# EAGLE design sanguinololu (EAGLE 5.11)
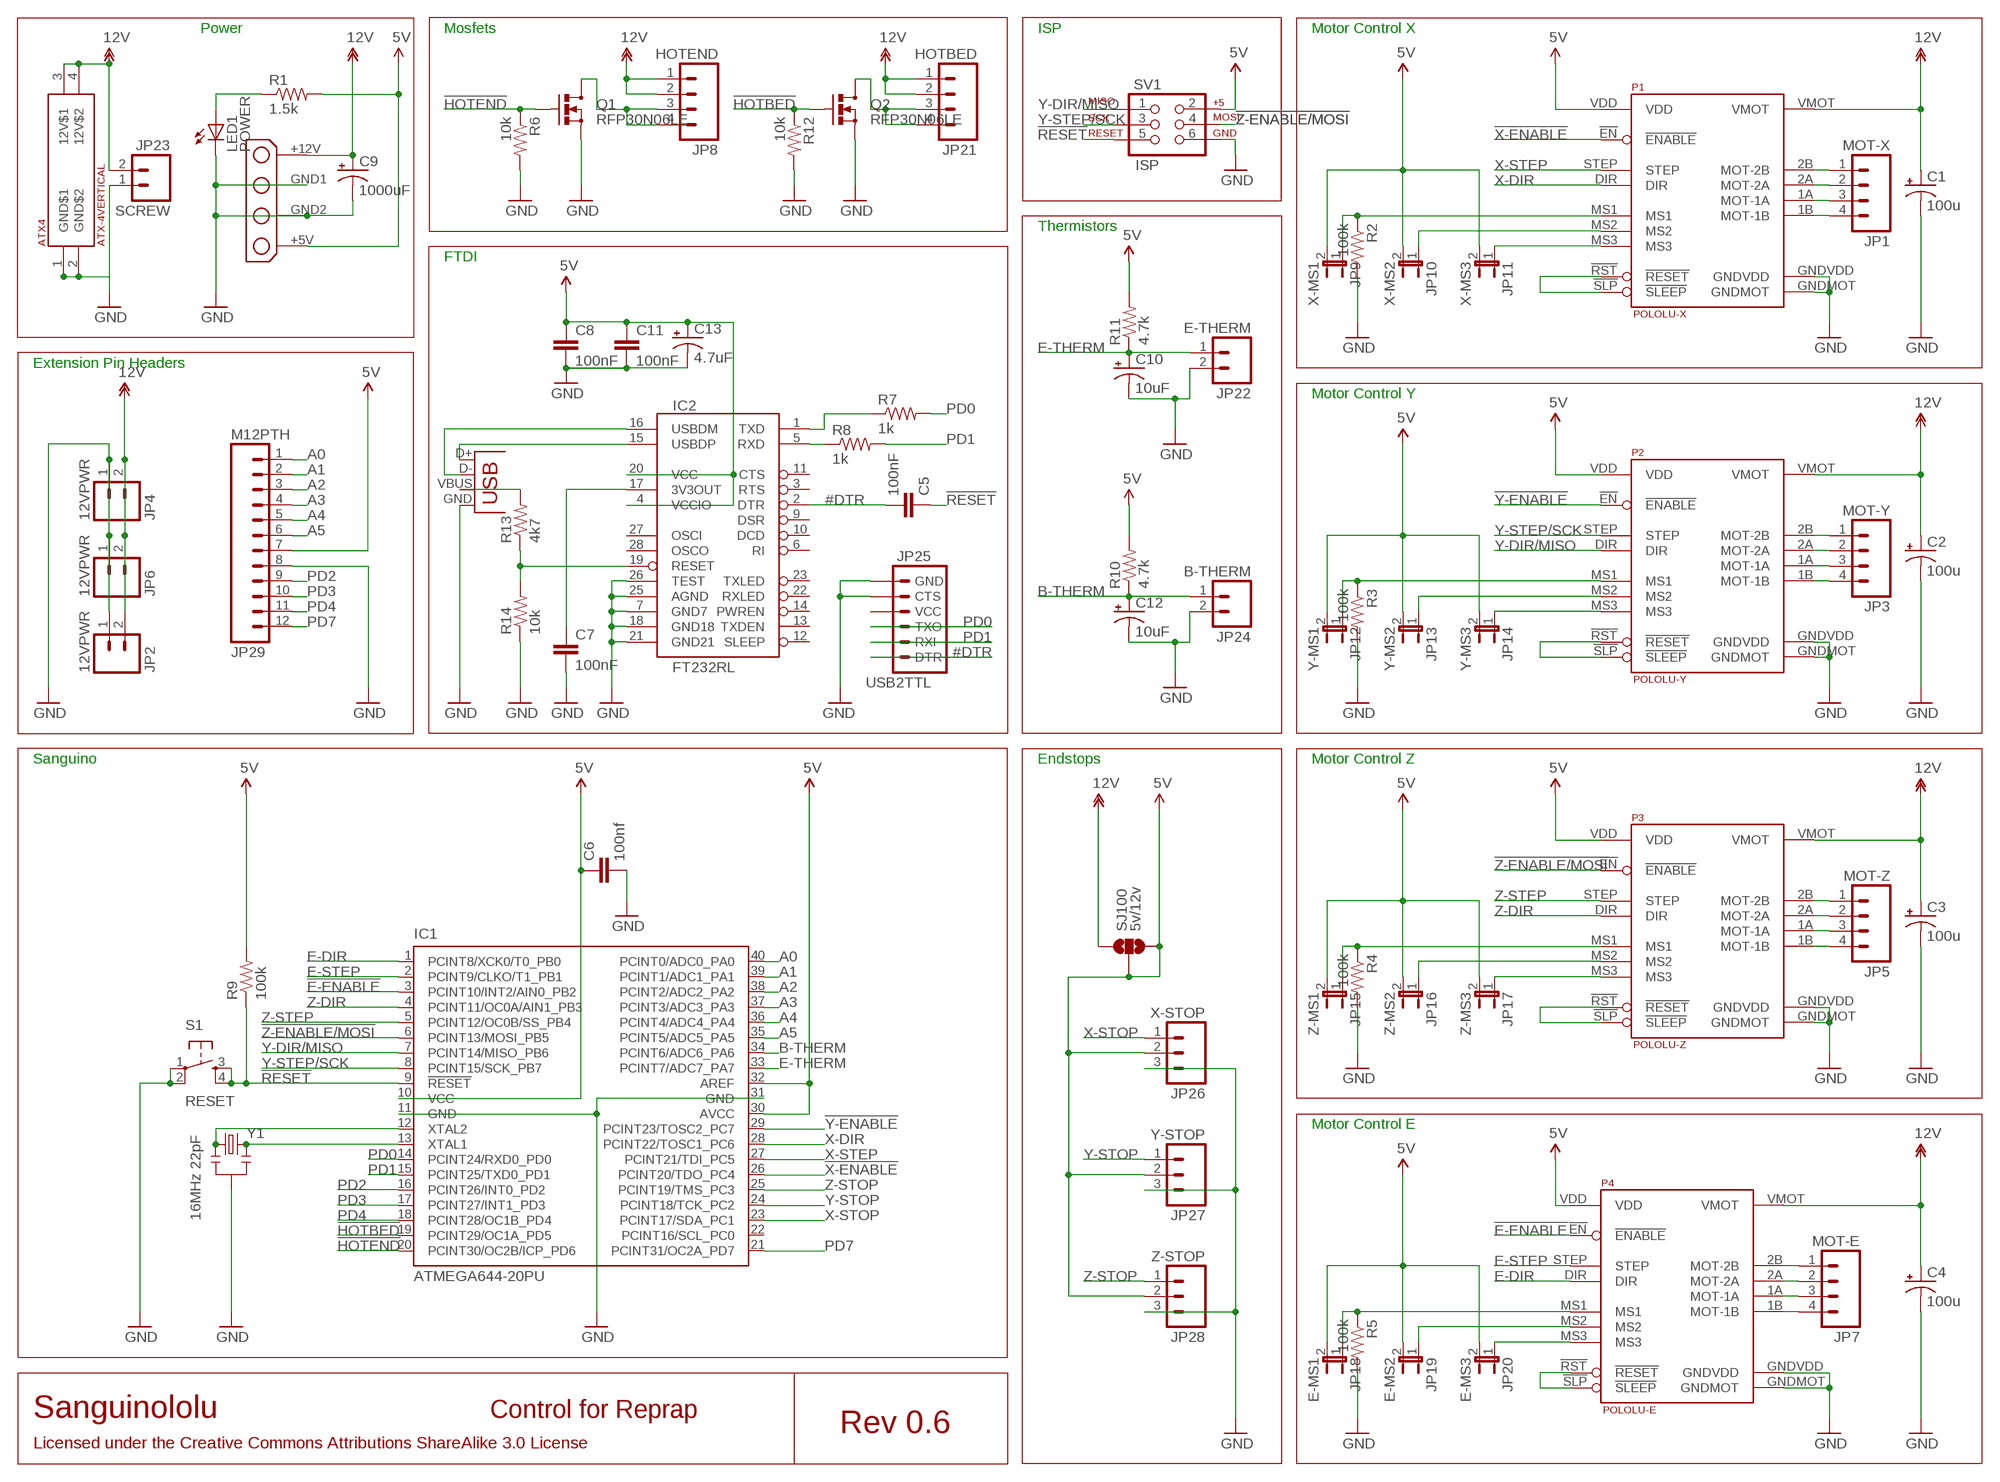
[diagram p0: schematic, sheet 1]

## Parts
ATX4  ATX-4VERTICAL  [MINIFITJR-4-VERTICAL]
C1  100u  CAP_POLPTH1  [CPOL-RADIAL-100UF-25V]
C2  100u  CAP_POLPTH1  [CPOL-RADIAL-100UF-25V]
C3  100u  CAP_POLPTH1  [CPOL-RADIAL-100UF-25V]
C4  100u  CAP_POLPTH1  [CPOL-RADIAL-100UF-25V]
C5  100nF  CAPPTH2  [CAP-PTH-SMALL2]
C6  100nf  CAPPTH2  [CAP-PTH-SMALL2]
C7  100nF  CAPPTH2  [CAP-PTH-SMALL2]
C8  100nF  CAPPTH2  [CAP-PTH-SMALL2]
C9  1000uF  CAP_POLPTH4  [CPOL-RADIAL-1000UF-25V]
C10  10uF  CAP_POLPTH2  [CPOL-RADIAL-10UF-25V]
C11  100nF  CAPPTH2  [CAP-PTH-SMALL2]
C12  10uF  CAP_POLPTH2  [CPOL-RADIAL-10UF-25V]
C13  4.7uF  CAP_POLPTH2  [CPOL-RADIAL-10UF-25V]
HDDPWR  5v/12v  DRIVEPWRVERTICAL  [HDD-VERTICAL]
IC1  ATMEGA644-20PU  [DIL40]
IC2  FT232RL  FT232RLSSOP  [SSOP28DB]
J1  USB  USBPTH  [USB-B-PTH]
JP1  MOT-X  M04POLAR  [MOLEX-1X4]
JP2  12VPWR  M02POLAR  [MOLEX-1X2]
JP3  MOT-Y  M04POLAR  [MOLEX-1X4]
JP4  12VPWR  M02POLAR  [MOLEX-1X2]
JP5  MOT-Z  M04POLAR  [MOLEX-1X4]
JP6  12VPWR  M02POLAR  [MOLEX-1X2]
JP7  MOT-E  M04POLAR  [MOLEX-1X4]
JP8  HOTEND  M04POLAR  [MOLEX-1X4]
JP9  X-MS1  JUMPER-2PTH  [1X02]
JP10  X-MS2  JUMPER-2PTH  [1X02]
JP11  X-MS3  JUMPER-2PTH  [1X02]
JP12  Y-MS1  JUMPER-2PTH  [1X02]
JP13  Y-MS2  JUMPER-2PTH  [1X02]
JP14  Y-MS3  JUMPER-2PTH  [1X02]
JP15  Z-MS1  JUMPER-2PTH  [1X02]
JP16  Z-MS2  JUMPER-2PTH  [1X02]
JP17  Z-MS3  JUMPER-2PTH  [1X02]
JP18  E-MS1  JUMPER-2PTH  [1X02]
JP19  E-MS2  JUMPER-2PTH  [1X02]
JP20  E-MS3  JUMPER-2PTH  [1X02]
JP21  HOTBED  M04POLAR  [MOLEX-1X4]
JP22  E-THERM  M02PTH  [1X02]
JP23  SCREW  M025MM  [SCREWTERMINAL-5MM-2]
JP24  B-THERM  M02PTH  [1X02]
JP25  USB2TTL  ARDUINO_SERIAL_PROGRAMPTH  [1X06]
JP26  X-STOP  M03POLAR  [MOLEX-1X3]
JP27  Y-STOP  M03POLAR  [MOLEX-1X3]
JP28  Z-STOP  M03POLAR  [MOLEX-1X3]
JP29  M12PTH  [1X12]
LED1  POWER  LED3MM  [LED3MM]
P1  POLOLU-X  POLOLU-ALLEGRO  [POLOLU-ALLEGRO-PTH]
P2  POLOLU-Y  POLOLU-ALLEGRO  [POLOLU-ALLEGRO-PTH]
P3  POLOLU-Z  POLOLU-ALLEGRO  [POLOLU-ALLEGRO-PTH]
P4  POLOLU-E  POLOLU-ALLEGRO  [POLOLU-ALLEGRO-PTH]
Q1  RFP30N06LE  MOSFET-NCHANNELPTH2  [TO220V]
Q2  RFP30N06LE  MOSFET-NCHANNELPTH2  [TO220V]
R1  1.5k  RESISTORPTH1  [AXIAL-0.3]
R2  100k  RESISTORPTH1  [AXIAL-0.3]
R3  100k  RESISTORPTH1  [AXIAL-0.3]
R4  100k  RESISTORPTH1  [AXIAL-0.3]
R5  100k  RESISTORPTH1  [AXIAL-0.3]
R6  10k  RESISTORPTH1  [AXIAL-0.3]
R7  1k  RESISTORPTH1  [AXIAL-0.3]
R8  1k  RESISTORPTH1  [AXIAL-0.3]
R9  100k  RESISTORPTH1  [AXIAL-0.3]
R10  4.7k  RESISTORPTH1  [AXIAL-0.3]
R11  4.7k  RESISTORPTH1  [AXIAL-0.3]
R12  10k  RESISTORPTH1  [AXIAL-0.3]
R13  4k7  RESISTORPTH1  [AXIAL-0.3]
R14  10k  RESISTORPTH1  [AXIAL-0.3]
S1  RESET  TAC_SWITCHPTH  [TACTILE-PTH]
SJ100  5v/12v  SOLDERJUMPER_2WAYS  [SJ_3]
SV1  ISP  AVR_SPI_PRG_6PTH  [2X3]
Y1  16MHz 22pF  RESONATORPTH  [RESONATOR-PTH]

## Nets
3V3: C7.1 IC2.17(3V3OUT)
5V: C6.1 C8.1 C11.1 C13.1(+) HDDPWR.+5V IC1.10(VCC) IC1.30(AVCC) IC1.32(AREF) IC2.4(VCCIO) IC2.20(VCC) JP9.2 JP10.2 JP11.2 JP12.2 JP13.2 JP14.2 JP15.2 JP16.2 JP17.2 JP18.2 JP19.2 JP20.2 JP26.2 JP27.2 JP28.2 JP29.7 P1.VDD P2.VDD P3.VDD P4.VDD R1.P$2 R9.P$2 R10.P$2 R11.P$2 SJ100.2 SJ100.3 SV1.2
12V: ATX4.3(12V$1) ATX4.4(12V$2) C1.1(+) C2.1(+) C3.1(+) C4.1(+) C9.1(+) HDDPWR.+12V JP2.2 JP4.2 JP6.2 JP8.1 JP8.2 JP21.1 JP21.2 JP23.2 P1.VMOT P2.VMOT P3.VMOT P4.VMOT SJ100.1
!E-ENABLE: IC1.3(PCINT10/INT2/AIN0_PB2) P4.!EN(!ENABLE)
!HOTBED: IC1.19(PCINT29/OC1A_PD5) Q2.1(G) R12.P$1
!HOTEND: IC1.20(PCINT30/OC2B/ICP_PD6) Q1.1(G) R6.P$1
!RESET: C5.1 IC1.9(!RESET) R9.P$1 S1.3 S1.4 SV1.5
!USB-RESET: IC2.19(RESET) R13.P$1 R14.P$2
!X-ENABLE: IC1.26(PCINT20/TDO_PC4) P1.!EN(!ENABLE)
!Y-ENABLE: IC1.29(PCINT23/TOSC2_PC7) P2.!EN(!ENABLE)
!Z-ENABLE/MOSI: IC1.6(PCINT13/MOSI_PB5) P3.!EN(!ENABLE) SV1.4
#DTR: C5.2 IC2.2(DTR) JP25.1(DTR)
A0: IC1.40(PCINT0/ADC0_PA0) JP29.1
A1: IC1.39(PCINT1/ADC1_PA1) JP29.2
A2: IC1.38(PCINT2/ADC2_PA2) JP29.3
A3: IC1.37(PCINT3/ADC3_PA3) JP29.4
A4: IC1.36(PCINT4/ADC4_PA4) JP29.5
A5: IC1.35(PCINT5/ADC5_PA5) JP29.6
B-THERM: C12.1(+) IC1.34(PCINT6/ADC6_PA6) JP24.1 R10.P$1
E-DIR: IC1.1(PCINT8/XCK0/T0_PB0) P4.DIR
E-MOT-1A1 [power]: JP7.3 P4.1A(MOT-1A)
E-MOT-1B1 [power]: JP7.4 P4.1B(MOT-1B)
E-MOT-2A1 [power]: JP7.2 P4.2A(MOT-2A)
E-MOT-2B1 [power]: JP7.1 P4.2B(MOT-2B)
E-MS1: JP18.1 P4.MS1 R5.P$1
E-MS2: JP19.1 P4.MS2
E-MS3: JP20.1 P4.MS3
E-RESETSLEEP: P4.!RST(!RESET) P4.!SLP(!SLEEP)
E-STEP: IC1.2(PCINT9/CLKO/T1_PB1) P4.STEP
E-THERM: C10.1(+) IC1.33(PCINT7/ADC7_PA7) JP22.1 R11.P$1
GND [power]: ATX4.1(GND$1) ATX4.2(GND$2) C1.2(-) C2.2(-) C3.2(-) C4.2(-) C6.2 C7.2 C8.2 C9.2(-) C10.2(-) C11.2 C12.2(-) C13.2(-) HDDPWR.GND1(GND) HDDPWR.GND2(_GND) IC1.11(GND) IC1.31(GND) IC2.7(GND7) IC2.18(GND18) IC2.21(GND21) IC2.25(AGND) IC2.26(TEST) J1.GND JP2.1 JP4.1 JP6.1 JP22.2 JP23.1 JP24.2 JP25.5(CTS) JP25.6(GND) JP26.3 JP27.3 JP28.3 JP29.8 LED1.K(C) P1.GNDMOT P1.GNDVDD P2.GNDMOT P2.GNDVDD P3.GNDMOT P3.GNDVDD P4.GNDMOT P4.GNDVDD Q1.3(S) Q2.3(S) R2.P$2 R3.P$2 R4.P$2 R5.P$2 R6.P$2 R12.P$2 R14.P$1 S1.1 S1.2 SV1.6 Y1.2
HOTBED-GND [power]: JP21.3 JP21.4 Q2.2(D)
HOTEND-GND [power]: JP8.3 JP8.4 Q1.2(D)
LED1: LED1.A R1.P$1
PD0: IC1.14(PCINT24/RXD0_PD0) JP25.3(TXO) R7.P$2
PD1: IC1.15(PCINT25/TXD0_PD1) JP25.2(RXI) R8.P$2
PD2: IC1.16(PCINT26/INT0_PD2) JP29.9
PD3: IC1.17(PCINT27/INT1_PD3) JP29.10
PD4: IC1.18(PCINT28/OC1B_PD4) JP29.11
PD7: IC1.21(PCINT31/OC2A_PD7) JP29.12
USB-RXD: IC2.5(RXD) R8.P$1
USB-TXD: IC2.1(TXD) R7.P$1
USBDM: IC2.16(USBDM) J1.D-
USBDP: IC2.15(USBDP) J1.D+
VBUS: J1.VBUS R13.P$2
X-DIR: IC1.28(PCINT22/TOSC1_PC6) P1.DIR
X-MOT-1A [power]: JP1.3 P1.1A(MOT-1A)
X-MOT-1B [power]: JP1.4 P1.1B(MOT-1B)
X-MOT-2A [power]: JP1.2 P1.2A(MOT-2A)
X-MOT-2B [power]: JP1.1 P1.2B(MOT-2B)
X-MS1: JP9.1 P1.MS1 R2.P$1
X-MS2: JP10.1 P1.MS2
X-MS3: JP11.1 P1.MS3
X-RESETSLEEP: P1.!RST(!RESET) P1.!SLP(!SLEEP)
X-STEP: IC1.27(PCINT21/TDI_PC5) P1.STEP
X-STOP: IC1.23(PCINT17/SDA_PC1) JP26.1
XTAL1: IC1.13(XTAL1) Y1.3
XTAL2: IC1.12(XTAL2) Y1.1
Y-DIR/MISO: IC1.7(PCINT14/MISO_PB6) P2.DIR SV1.1
Y-MOT-1A [power]: JP3.3 P2.1A(MOT-1A)
Y-MOT-1B [power]: JP3.4 P2.1B(MOT-1B)
Y-MOT-2A [power]: JP3.2 P2.2A(MOT-2A)
Y-MOT-2B [power]: JP3.1 P2.2B(MOT-2B)
Y-MS1: JP12.1 P2.MS1 R3.P$1
Y-MS2: JP13.1 P2.MS2
Y-MS3: JP14.1 P2.MS3
Y-RESETSLEEP: P2.!RST(!RESET) P2.!SLP(!SLEEP)
Y-STEP/SCK: IC1.8(PCINT15/SCK_PB7) P2.STEP SV1.3
Y-STOP: IC1.24(PCINT18/TCK_PC2) JP27.1
Z-DIR: IC1.4(PCINT11/OC0A/AIN1_PB3) P3.DIR
Z-MOT-1A [power]: JP5.3 P3.1A(MOT-1A)
Z-MOT-1B [power]: JP5.4 P3.1B(MOT-1B)
Z-MOT-2A [power]: JP5.2 P3.2A(MOT-2A)
Z-MOT-2B [power]: JP5.1 P3.2B(MOT-2B)
Z-MS1: JP15.1 P3.MS1 R4.P$1
Z-MS2: JP16.1 P3.MS2
Z-MS3: JP17.1 P3.MS3
Z-RESETSLEEP: P3.!RST(!RESET) P3.!SLP(!SLEEP)
Z-STEP: IC1.5(PCINT12/OC0B/SS_PB4) P3.STEP
Z-STOP: IC1.25(PCINT19/TMS_PC3) JP28.1
Unconnected: IC1.22(PCINT16/SCL_PC0) IC2.3(RTS) IC2.6(RI) IC2.9(DSR) IC2.10(DCD) IC2.11(CTS) IC2.12(SLEEP) IC2.13(TXDEN) IC2.14(PWREN) IC2.22(RXLED) IC2.23(TXLED) IC2.27(OSCI) IC2.28(OSCO) JP25.4(VCC)

## Notes on the sheet
- Power | Mosfets | ISP | Motor Control X
- Thermistors
- FTDI
- Extension Pin Headers
- Motor Control Y
- Sanguino | Endstops | Motor Control Z
- Motor Control E
- Sanguinololu | Control for Reprap
- Rev 0.6
- Licensed under the Creative Commons Attributions ShareAlike 3.0 License

## Library data of the parts
ATX4 = atx-power-supply:ATX-4
C1-C4 C9 C10 C12 C13 = SparkFun:CAP_POL: Capacitor Polarized These are standard SMD and PTH capacitors. Normally 10uF, 47uF, and 100uF in electrolytic and tantalum varieties. Always verify the external diameter of the through hole cap, it varies with capacity, voltage, and manufacturer. The EIA devices should be standard.
C5-C8 C11 = SparkFun:CAP: Capacitor Standard 0603 ceramic capacitor, and 0.1" leaded capacitor.
HDDPWR = atx-power-supply:DRIVEPWR
IC1 = atmel:ATMEGA644-*PU: 8-bit Microcontroller with 64K Bytes In-System Programmable Flash Auto generated by make-symbol-device-package-bsdl.ulp Rev. 34 Source: http://www.atmel.com/dyn/resources/prod_documents/doc2593.pdf; MPN: ATMEGA644-20PU; OC_FARNELL: 1288340; OC_NEWARK: 23M5060
IC2 = SparkFun:FT232RL: USB UART FT232RL 4th Generation USB UART (USB <-> Serial) Controller. Spark Fun Electronics SKU : COM-00650
J1 = SparkFun:USB: USB Connectors USB-B-PTH is fully proven SKU : PRT-00139 USB-miniB is fully proven SKU : PRT-00587 USB-A-PCB is untested. USB-A-H is throughly reviewed, but untested. Spark Fun Electronics SKU : PRT-00437 USB-B-SMT is throughly reviewed, but untested. Needs silkscreen touching up. USB-A-S has not been used/tested USB-MB-H has not been used/tested
JP1 JP3 JP5 JP7 JP8 JP21 = SparkFun:M04: Header 4 Standard 4-pin 0.1" header. Use with straight break away headers (SKU : PRT-00116), right angle break away headers (PRT-00553), swiss pins (PRT-00743), machine pins (PRT-00117), and female headers (PRT-00115). Molex polarized connector foot print use with SKU : PRT-08231 with associated crimp pins and housings.
JP2 JP4 JP6 JP22-JP24 = SparkFun:M02: Header 2 Standard 2-pin 0.1" header. Use with straight break away headers (SKU : PRT-00116), right angle break away headers (PRT-00553), swiss pins (PRT-00743), machine pins (PRT-00117), and female headers (PRT-00115). Molex polarized connector foot print use with SKU : PRT-08233 with associated crimp pins and housings.
JP9-JP20 = SparkFun:JUMPER-2: Jumper Basic 0.1" spaced jumper. Use with breakaway headers.
JP25 = SparkFun:ARDUINO_SERIAL_PROGRAM
JP26-JP28 = SparkFun:M03: Header 3 Standard 3-pin 0.1" header. Use with straight break away headers (SKU : PRT-00116), right angle break away headers (PRT-00553), swiss pins (PRT-00743), machine pins (PRT-00117), and female headers (PRT-00115). Molex polarized connector foot print use with SKU : PRT-08232 with associated crimp pins and housings.
JP29 = SparkFun:M12: Header 12 Standard 12-pin 0.1" header. Use with straight break away headers (SKU : PRT-00116), right angle break away headers (PRT-00553), swiss pins (PRT-00743), machine pins (PRT-00117), and female headers (PRT-00115).
LED1 = SparkFun:LED: LEDs Standard schematic elements and footprints for 5mm, 3mm, 1206, and 0603 sized LEDs. 5mm - Spark Fun Electronics SKU : COM-00529 (and others)
P1-P4 = pololu-allegro:POLOLU-ALLEGRO
Q1 Q2 = SparkFun:MOSFET-NCHANNEL
R1-R14 = SparkFun:RESISTOR: Resistor Basic schematic elements and footprints for 0603, 1206, and PTH 1/10th watt (small) resistors.
S1 = SparkFun:TAC_SWITCH: Momentary Switch Button commonly used for reset or general input. Spark Fun Electronics SKU : COM-00097
SJ100 = SparkFun:SOLDERJUMPER_2WAY: Solder Jumper 2 way solder jumper
SV1 = SparkFun:AVR_SPI_PRG_6: AVR ISP 6 Pin This is the reduced ISP connector for AVR programming. Common on Arduino. This footprint will take up less PCB space and can be used with a 10-pin to 6-pin adapter such as SKU: BOB-08508
Y1 = SparkFun:RESONATOR: Resonator Small SMD resonator. This is the itty bitty 10/20MHz resonators with built in caps. CSTCE10M0G55 and CSTCE20M0V53. Footprint has been reviewed closely but hasn't been tested yet.

## Board
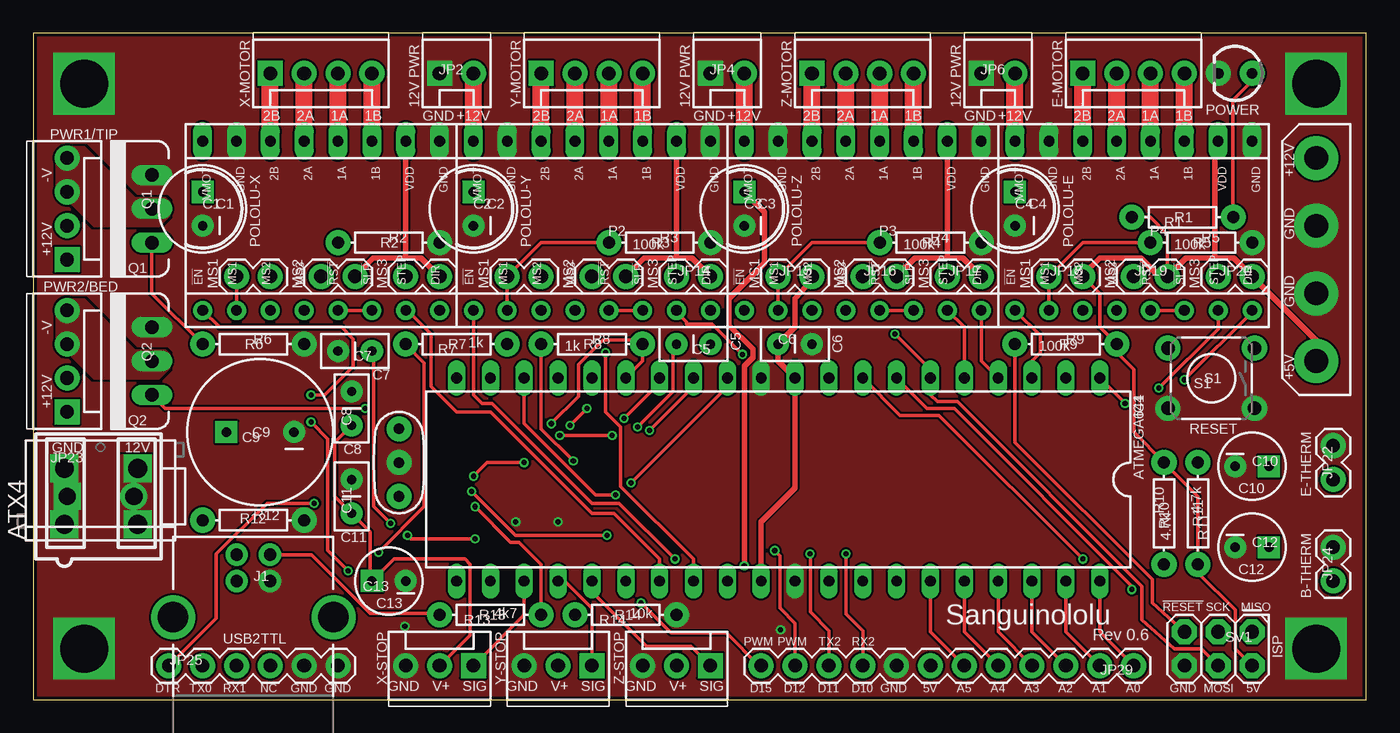
[diagram p1: board, top side]
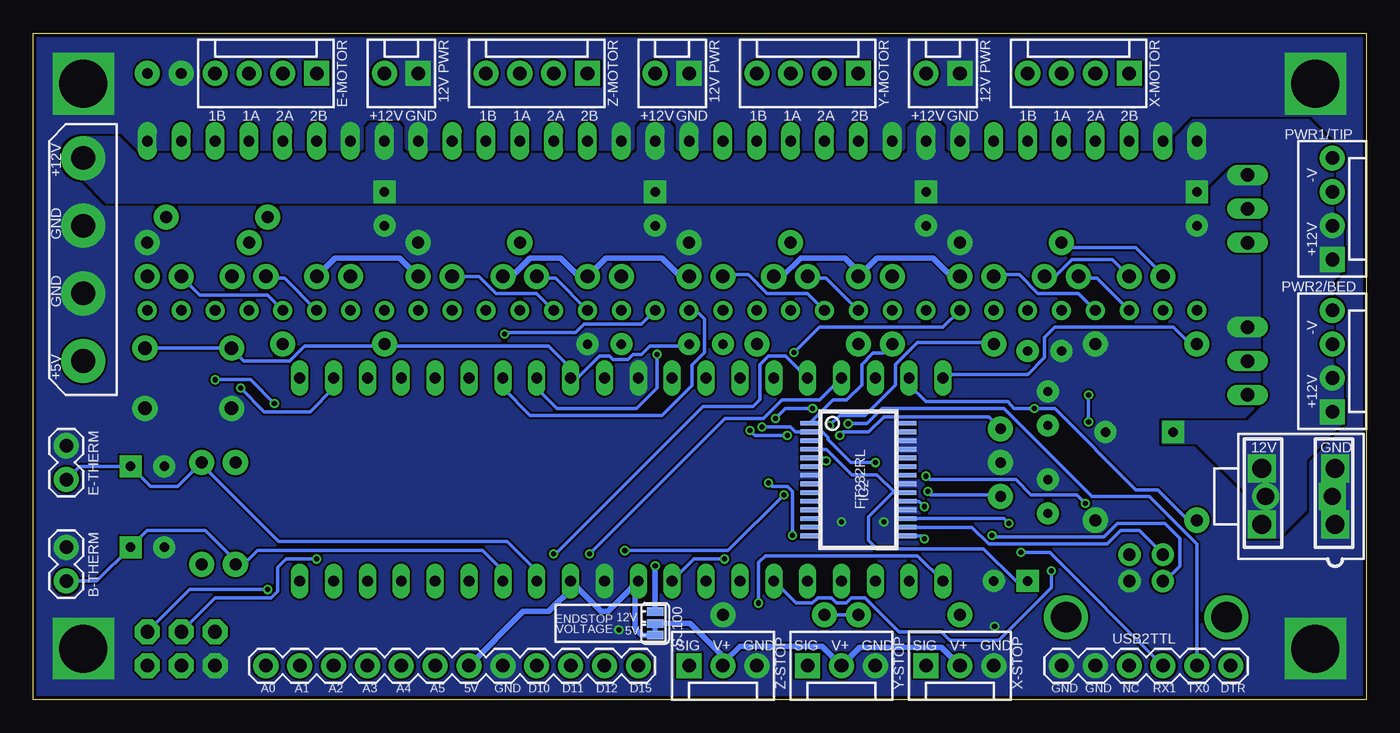
[diagram p2: board, bottom side, seen from below]

Size 100 x 50 mm. Coordinates in mm from the lower left corner, seen from the top.
Outline: 0,0 100,0 100,50 0,50 0,0
Copper layers (1*16): Top 0.035mm / dielectric 1.5mm / Bottom 0.035mm
Design rules "Fusion_eagle_rule_v1.1": minimum track width 6mil, minimum drill 12mil, track to track 6mil, track to pad 6mil, pad to pad 6mil, via to via 6mil, smd to smd 0mil, copper to edge 10mil, drill to drill 10mil, minimum pad ring 10mil, minimum via ring 6mil, stop-mask expansion 2mil, vias tented up to drill 100mil, thermal gap 10mil

### Footprints (pad centres in the part's own frame; a part is rotated, then mirrored left to right if it is on the bottom)
MINIFITJR-4-VERTICAL = drill 1.4 square: 1 2.1,-2.75; 2 -2.1,-2.75; 3 2.1,2.75; 4 -2.1,2.75
CPOL-RADIAL-100UF-25V = drill 0.7 pad 1.651 square: 1 1.27,0 | drill 0.7 pad 1.651 round: 2 -1.27,0
CAP-PTH-SMALL2 = drill 0.7 pad 1.651 round: 1 0,0; 2 2.54,0
CPOL-RADIAL-1000UF-25V = drill 0.7 pad 1.651 square: 1 2.54,0 | drill 0.7 pad 1.651 round: 2 -2.54,0
CPOL-RADIAL-10UF-25V = drill 0.7 pad 1.651 square: 1 1.27,0 | drill 0.7 pad 1.651 round: 2 -1.27,0
HDD-VERTICAL = drill 1.778 pad 3.302 round: +5V -15.24,0; +12V 0,0; GND1 -10.16,0; GND2 -5.08,0
DIL40 = drill 0.813 long: 1 -24.13,-7.62; 2 -21.59,-7.62; 3 -19.05,-7.62; 4 -16.51,-7.62; 5 -13.97,-7.62; 6 -11.43,-7.62; 7 -8.89,-7.62; 8 -6.35,-7.62; 9 -3.81,-7.62; 10 -1.27,-7.62; 11 1.27,-7.62; 12 3.81,-7.62; 13 6.35,-7.62; 14 8.89,-7.62; 15 11.43,-7.62; 16 13.97,-7.62; 17 16.51,-7.62; 18 19.05,-7.62; 19 21.59,-7.62; 20 24.13,-7.62; 21 24.13,7.62; 22 21.59,7.62; 23 19.05,7.62; 24 16.51,7.62; 25 13.97,7.62; 26 11.43,7.62; 27 8.89,7.62; 28 6.35,7.62; 29 3.81,7.62; 30 1.27,7.62; 31 -1.27,7.62; 32 -3.81,7.62; 33 -6.35,7.62; 34 -8.89,7.62; 35 -11.43,7.62; 36 -13.97,7.62; 37 -16.51,7.62; 38 -19.05,7.62; 39 -21.59,7.62; 40 -24.13,7.62
SSOP28DB = smd 0.348 x 1.397: 1 -4.225,-3.656; 2 -3.575,-3.656; 3 -2.925,-3.656; 4 -2.275,-3.656; 5 -1.625,-3.656; 6 -0.975,-3.656; 7 -0.325,-3.656; 8 0.325,-3.656; 9 0.975,-3.656; 10 1.625,-3.656; 11 2.275,-3.656; 12 2.925,-3.656; 13 3.575,-3.656; 14 4.225,-3.656; 15 4.225,3.656; 16 3.575,3.656; 17 2.925,3.656; 18 2.275,3.656; 19 1.625,3.656; 20 0.975,3.656; 21 0.325,3.656; 22 -0.325,3.656; 23 -0.975,3.656; 24 -1.625,3.656; 25 -2.275,3.656; 26 -2.925,3.656; 27 -3.575,3.656; 28 -4.225,3.656
USB-B-PTH = drill 0.914 pad 1.676 round: D+ 0,1.25; D- 1.981,1.25; GND 0,-1.25; VBUS 1.981,-1.25 | drill 2.286 round: P$1 -2.718,-6.02; P$2 -2.718,6.02
MOLEX-1X4 = drill 1.016 pad 1.88 square: 1 0,0 | drill 1.016 pad 1.88 round: 2 2.54,0; 3 5.08,0; 4 7.62,0
MOLEX-1X2 = drill 1.016 pad 1.88 square: 1 0,0 | drill 1.016 pad 1.88 round: 2 2.54,0
1X02 = drill 1.016 pad 1.88 round: 1 0,0; 2 2.54,0
SCREWTERMINAL-5MM-2 = drill 1.3 pad 2.032 square: 1 0,0 | drill 1.3 pad 2.032 round: 2 5,0
1X06 = drill 1.016 pad 1.88 round: 1 0,0; 2 2.54,0; 3 5.08,0; 4 7.62,0; 5 10.16,0; 6 12.7,0
MOLEX-1X3 = drill 1.016 pad 1.88 square: 1 0,0 | drill 1.016 pad 1.88 round: 2 2.54,0; 3 5.08,0
1X12 = drill 1.016 pad 1.88 round: 1 0,0; 2 2.54,0; 3 5.08,0; 4 7.62,0; 5 10.16,0; 6 12.7,0; 7 15.24,0; 8 17.78,0; 9 20.32,0; 10 22.86,0; 11 25.4,0; 12 27.94,0
LED3MM = drill 0.813 pad 1.88 round: A -1.27,0; K 1.27,0
POLOLU-ALLEGRO-PTH = drill 0.8 pad 1.422 long: 1A 6.35,-1.27; 1B 6.35,-3.81; 2A 6.35,1.27; 2B 6.35,3.81; GNDMOT 6.35,6.35; GNDVDD 6.35,-8.89; VDD 6.35,-6.35; VMOT 6.35,8.89 | drill 0.8 pad 1.422 round: !EN -6.35,8.89; !RST -6.35,-1.27; !SLP -6.35,-3.81; DIR -6.35,-8.89; MS1 -6.35,6.35; MS2 -6.35,3.81; MS3 -6.35,1.27; STEP -6.35,-6.35
TO220V = drill 1.016 long: 1 -2.54,0; 2 0,0; 3 2.54,0
AXIAL-0.3 = drill 0.9 pad 1.88 round: P$1 -3.81,0; P$2 3.81,0
TACTILE-PTH = drill 1.016 pad 1.88 round: 1 -3.251,2.261; 2 3.251,2.261; 3 -3.251,-2.261; 4 3.251,-2.261
SJ_3 = smd 0.635 x 1.27: 1 -0.889,0; 2 0,0; 3 0.889,0
2X3 = drill 1.016 pad 1.88 octagon: 1 0,0; 2 0,2.54; 3 2.54,0; 4 2.54,2.54; 5 5.08,0; 6 5.08,2.54
RESONATOR-PTH = drill 0.8 pad 1.88 round: 1 -2.54,0; 2 0,0; 3 2.54,0

### Placement (x,y rotation side)
ATX4  5.08,15.24 270 top
C1  12.7,36.83 90 top
C2  33.02,36.83 90 top
C3  53.34,36.83 90 top
C4  73.66,36.83 90 top
C5  50.8,26.67 180 top
C6  55.88,26.67 0 top
C7  25.4,26.16 180 top
C8  23.88,20.57 90 top
C9  17.02,20.07 180 top
C10  91.44,17.51 0 top
C11  23.88,13.97 90 top
C12  91.44,11.43 0 top
C13  26.67,8.89 180 top
HDDPWR  96.25,40.64 90 top
IC1  55.88,16.51 180 top
IC2  38.1,16.51 270 bottom
J1  16.51,8.89 90 top
JP1  17.78,46.99 0 top
JP2  30.48,46.99 0 top
JP3  38.1,46.99 0 top
JP4  50.8,46.99 0 top
JP5  58.42,46.99 0 top
JP6  71.12,46.99 0 top
JP7  78.74,46.99 0 top
JP8  2.54,33.02 90 top
JP9  15.24,31.75 0 top
JP10  21.59,31.75 0 top
JP11  27.94,31.75 0 top
JP12  35.56,31.75 0 top
JP13  41.91,31.75 0 top
JP14  48.26,31.75 0 top
JP15  55.88,31.75 0 top
JP16  62.23,31.75 0 top
JP17  68.58,31.75 0 top
JP18  76.2,31.75 0 top
JP19  82.55,31.75 0 top
JP20  88.9,31.75 0 top
JP21  2.54,21.59 90 top
JP22  97.52,16.51 90 top
JP23  2.54,15.24 0 top
JP24  97.52,8.89 90 top
JP25  10.16,2.54 0 top
JP26  33.02,2.54 180 top
JP27  41.91,2.54 180 top
JP28  50.8,2.54 180 top
JP29  82.55,2.54 180 top
LED1  90.17,46.99 180 top
P1  21.59,35.56 90 top
P2  41.91,35.56 90 top
P3  62.23,35.56 90 top
P4  82.55,35.56 90 top
Q1  8.89,36.83 90 top
Q2  8.89,25.4 90 top
R1  86.23,36.2 180 top
R2  26.67,34.29 0 top
R3  46.99,34.29 0 top
R4  67.31,34.29 0 top
R5  87.63,34.29 0 top
R6  16.51,26.67 0 top
R7  31.75,26.67 180 top
R8  41.91,26.67 0 top
R9  77.47,26.67 0 top
R10  84.84,13.97 90 top
R11  87.38,13.97 270 top
R12  16.51,13.46 0 top
R13  34.29,6.35 180 top
R14  44.45,6.35 180 top
S1  88.38,24.11 180 top
SJ100  53.34,5.71 270 bottom
SV1  91.44,5.08 180 top
Y1  27.43,17.78 90 top

### Tracks (layer width: path | path; a pad name or v marks a point on that pad's centre or on a via)
3V3  (via drill 0.38)
  Top 0.254: v26.8,13.21 25.53,14.48 25.53,26.04 C7.1
  Bottom 0.254: v26.8,13.21 26.81,13.21 27.19,13.59 IC2.17
5V
  Top 0.254: SV1.2 90.17,3.81 90.17,6.73 87.38,9.53 R11.P$2 87.38,15.24 R10.P$2 82.55,20.07 82.55,24.77 81.28,26.04 R9.P$2 80.01,27.94 80.01,30.48 JP18.2 78.74,31.88 | C8.1 22.61,19.3 22.61,15.24 C11.1 25.27,12.57 25.27,9.02 C13.1 27.05,10.54 32.38,10.54 32.77,10.16 32.77,4.83 JP26.2 | JP19.2 85.09,34.91 83.81,36.2 R1.P$2
  Top 0.406: JP15.2 58.42,31.5 57.15,30.1 57.15,27.94 C6.1 55.88,25.4 IC1.10 57.15,15.88 54.61,13.34 IC1.30 | 88.65,33.13 86.47,33.13 JP19.2 84.49,31.75 83.09,33.15 80.01,33.15 78.74,31.88 | 88.65,33.13 90.06,33.13 JP20.2 96.25,26.94 HDDPWR.+5V | JP10.2 25.51,33.13 27.94,33.13 | 27.94,33.13 29.1,33.13 JP11.2 | JP13.2 45.83,33.13 48.26,33.13 | 48.26,33.13 49.42,33.13 JP14.2 | JP16.2 66.15,33.13 68.58,33.13 | 68.58,33.13 69.74,33.13 JP17.2 | P4.VDD 88.9,41.02 88.65,40.64 88.65,33.13 | 68.58,33.13 P3.VDD | 48.26,33.13 P2.VDD | 27.94,33.13 P1.VDD
  Bottom 0.254: C13.1 26.29,8.89 28.7,11.3 36.7,11.3 37.34,11.94 37.34,13.72 35.52,15.54 35.37,15.54 | JP9.2 19.05,33.02 22.1,33.02 23.37,31.75 JP10.2 | 54.86,8.89 IC1.30 | IC1.32 59.44,8.51 | 37.97,32 JP12.2 | IC2.4 40.5,18.79 38.59,16.87 36.7,16.87 35.37,15.54 | 35.37,15.54 IC2.20
  Bottom 0.406: JP12.2 36.7,33.15 32.51,33.15 31.11,31.75 JP11.2 | IC1.32 57.4,6.6 56.9,6.6 IC1.30 | JP29.7 63.25,6.6 61.34,6.6 59.44,8.51 | JP14.2 51.44,31.75 52.83,33.15 57.02,33.15 JP15.2 59.05,31.75 60.45,33.15 62.74,33.15 64.14,31.75 JP16.2 | 37.97,32 39.12,33.15 42.42,33.15 43.81,31.75 JP13.2 | 54.86,8.89 54.86,5.33 54.36,4.83 SJ100.3 SJ100.2 50.72,5.71 48.26,3.26 JP28.2 48.26,2.74 47,4 40.83,4 JP27.2 37.97,3.94 31.88,3.94 JP26.2 | JP17.2 72.52,33.15 77.34,33.15 JP18.2
12V  (via drill 0.38)
  Top 0.406: v53.34,10.03 53.34,25.02 53.98,25.65 53.98,26.29 52.2,28.07 52.2,30.1 54.86,32.77 54.86,36.32 54.86,36.58 C3.1
  Top 1.27: P2.VMOT JP2.2 | P3.VMOT JP4.2 | P4.VMOT JP6.2
  Bottom 0.406: SJ100.1 v53.34,10.03
  pour Top (no thermals): 6.6,12.19 6.6,18.29 8.89,18.29 8.89,12.19
  pour Bottom (no thermals): 2.54,36.58 2.54,41.66 4.32,43.43 12.95,43.43 14.22,42.16 14.22,41.15 14.48,40.89 31.5,40.89 31.75,41.15 31.75,42.93 32,43.18 34.04,43.18 34.29,42.93 34.29,41.15 34.54,40.89 51.82,40.89 52.07,41.15 52.07,42.93 52.32,43.18 54.36,43.18 54.61,42.93 54.61,41.15 54.86,40.89 72.14,40.89 72.39,41.15 72.39,42.93 72.64,43.18 74.68,43.18 74.93,42.93 74.93,41.15 75.18,40.89 92.33,40.89 93.6,42.16 96.27,42.16 arc-90 97.79,40.64 arc-90 96.27,39.12 94.49,37.34 11.94,37.34 11.94,38.61 10.41,40.13 7.62,40.13 7.62,22.1 8.89,20.83 15.24,20.83 15.24,19.3 12.7,19.3 8.89,15.49 8.89,12.19 6.6,12.19 4.57,14.22 4.57,18.03 1.78,20.83 1.78,24.38 2.54,25.15 2.54,31.5 1.78,32.26 1.78,35.81
!E-ENABLE
  Top 0.254: P4.!EN 75.56,27.3 75.56,26.04 74.93,25.4 IC1.3
!HOTBED  (via drill 0.38)
  Top 0.254: Q2.1 9.91,21.84 v24.89,21.84
  Bottom 0.254: 23.37,21.84 24.13,21.84 26.42,21.84 26.89,22.35 33.02,22.35 34.29,23.62 IC1.19 | 23.37,21.84 17.27,15.75 15.62,15.75 13.34,13.46 R12.P$1 | 23.37,21.84 v24.89,21.84
!HOTEND
  Top 0.254: Q1.1 8.89,30.48 R6.P$1
  Bottom 0.254: R6.P$1 13.21,26.67 14.48,27.94 23.37,27.94 24.13,27.18 24.13,25.65 25.4,24.38 31.5,24.38 IC1.20
!RESET
  Top 0.254: SV1.5 83.95,7.24 83.95,8.13 83.95,9.02 73.66,19.3 73.66,19.56 R9.P$1
  Bottom 0.254: C5.1 50.93,26.54 53.72,26.54 54.36,25.91 54.99,25.91 55.37,25.53 56.52,25.53 56.77,25.78 57.53,25.78 59.18,24.13 IC1.9 59.69,24.89 61.34,26.54 73.53,26.54 R9.P$1 73.66,26.54 79.63,26.54 80.77,25.4 84.2,25.4 85.12,26.32 S1.4 S1.3
!USB-RESET  (via drill 0.38)
  Top 0.254: v33.15,14.48 35.81,11.81 36.45,11.81 38.1,10.16 R13.P$1
  Bottom 0.254: R13.P$1 R14.P$2 | v33.15,14.48 33.55,14.88 IC2.19
!X-ENABLE  (via drill 0.38)
  Top 0.254: v23.62,9.65 22.1,11.18 22.1,15.49 22.1,19.05 22.1,19.56 v20.83,20.83 | v20.83,22.86 21.84,22.86 23.88,24.89 24,25.02 24,27.05 23.11,27.94 13.97,27.94 P1.!EN
  Bottom 0.254: IC1.26 42.8,7.24 41.53,7.24 41.15,7.62 40.13,7.62 39.75,7.24 38.99,7.24 38.61,7.62 37.59,7.62 35.05,5.08 31.88,5.08 31.24,4.45 27.56,4.45 23.62,8.38 v23.62,9.65 | v20.83,20.83 v20.83,22.86
!Y-ENABLE  (via drill 0.38)
  Top 0.254: v48.13,10.54 43.94,14.73 41.91,14.73 34.42,22.23 33.66,22.23 33.02,22.86 P2.!EN
  Bottom 0.254: IC1.29 50.42,10.54 v48.13,10.54
!Z-ENABLE/MOSI  (via drill 0.38)
  Top 0.254: v64.64,27.43 67.31,24.77 67.31,24.26 IC1.6 67.31,22.86 67.82,22.35 69.34,22.35 83.19,8.51 83.19,8.13 83.19,5.97 85.6,3.81 87.63,3.81 SV1.4
  Bottom 0.254: v64.64,27.43 64.52,27.56 59.31,27.56 58.67,28.19 54.36,28.19 P3.!EN
#DTR  (via drill 0.38)
  Top 0.254: v45.34,20.45 48.01,23.11 48.01,26.42 C5.2 | JP25.1 13.72,6.1 13.72,10.92 17.53,14.73 v21.08,14.73 | v33.02,16.76 34.04,17.78 v36.83,17.78
  Bottom 0.254: v21.08,14.73 21.72,15.37 25.15,15.37 26.29,16.51 32.77,16.51 v33.02,16.76 | v45.34,20.45 43.18,20.45 42.82,20.09 IC2.2 40.79,20.09 40.39,19.68 40.39,19.51 38.65,17.78 v36.83,17.78
A0
  Top 0.254: IC1.40 80.01,5.08 JP29.1
A1
  Top 0.254: IC1.39 77.47,5.08 JP29.2
A2
  Top 0.254: IC1.38 74.93,5.08 JP29.3
A3
  Top 0.254: IC1.37 72.39,5.08 JP29.4
A4
  Top 0.254: IC1.36 69.85,5.08 JP29.5
A5
  Top 0.254: IC1.35 67.31,5.08 JP29.6
B-THERM
  Bottom 0.254: JP24.1 95.25,8.89 C12.1 91.44,12.7 87.12,12.7 84.84,10.41 R10.P$1 84.2,10.16 83.19,11.18 66.29,11.18 64.77,9.65 IC1.34
E-DIR  (via drill 0.38)
  Top 0.254: IC1.1 v81.92,22.23 | v86.36,24 91.44,29.08 P4.DIR
  Bottom 0.254: v81.92,22.23 83.69,24 v86.36,24
E-MOT-1A1
  Top 1.27: P4.1A JP7.3
E-MOT-1B1
  Top 1.27: P4.1B JP7.4
E-MOT-2A1
  Top 1.27: P4.2A JP7.2
E-MOT-2B1
  Top 1.27: P4.2B JP7.1
E-MS1
  Top 0.254: P4.MS1 JP18.1 78.74,34.29 R5.P$1
E-MS2
  Bottom 0.254: P4.MS2 81.15,31.62 82.42,31.62 JP19.1
E-MS3
  Bottom 0.254: P4.MS3 82.42,30.35 87.5,30.35 JP20.1
E-RESETSLEEP
  Top 0.254: P4.!RST P4.!SLP
E-STEP  (via drill 0.38)
  Top 0.254: v84.45,23.37 88.9,27.81 P4.STEP
  Bottom 0.254: v84.45,23.37 82.68,21.59 79.25,21.59 77.47,23.37 IC1.2
E-THERM
  Bottom 0.254: IC1.33 62.23,9.65 64.45,11.88 81.6,11.88 87.38,17.65 R11.P$1 89.16,16 91.2,16 C10.1 96.52,17.51 JP22.1
GND  (via drill 0.38, 3.6)
  other vias: 3.81,46.22 3.81,3.81 96.25,3.81 96.25,46.22 36.2,13.34 39.37,13.34 56.07,5.24 27.88,5.49
  pour Top (rank 2, no thermals): 0,50 100,50 100,0 0,0
  pour Bottom (rank 2, no thermals): 0,50 100,50 100,0 0,0
HOTBED-GND
  pour Top (no thermals): 2.29,29.97 3.81,29.97 7.62,26.16 9.91,26.16 10.16,25.91 10.16,24.89 9.4,24.13 4.57,24.13 2.79,25.91 2.29,25.91 1.78,26.42 1.78,29.46
HOTEND-GND
  pour Top (no thermals): 2.29,41.4 3.81,41.4 7.62,37.59 9.91,37.59 10.16,37.34 10.16,36.32 9.4,35.56 4.57,35.56 2.79,37.34 2.29,37.34 1.78,37.85 1.78,40.89
LED1
  Top 0.254: R1.P$1 90,36.24 90,45 91.44,46.44 LED1.A
PD0  (via drill 0.38)
  Top 0.254: v40.26,20.57 v41.53,21.84 | v25.91,11.05 29.34,14.48 29.34,25.27 R7.P$2 | v44.32,21.08 46.99,23.75 IC1.14
  Bottom 0.254: v44.32,21.08 43.56,21.84 v41.53,21.84 | v40.26,20.57 39.5,21.34 37.59,21.34 35.31,23.62 35.31,25.15 33.66,26.8 28.07,26.8 R7.P$2 | JP25.3 23.75,11.05 v25.91,11.05
PD1  (via drill 0.38)
  Top 0.254: v38.86,20.7 40.89,22.73 40.89,25.15 42.75,27 45.39,27 R8.P$2 45.72,25.4 IC1.15
  Bottom 0.254: v38.86,20.7 37.47,20.7 36.32,21.84 27.18,21.84 20.57,15.24 16.26,15.24 12.7,11.68 JP25.2
PD2  (via drill 0.38)
  Top 0.254: v60.96,10.92 60.96,6.45 62.23,5.17 JP29.9
  Bottom 0.254: IC1.16 43.56,25.78 44.83,25.78 45.47,25.15 45.47,22.53 46,22 49.76,22 60.83,10.92 v60.96,10.92
PD3  (via drill 0.38)
  Top 0.254: v58.28,10.92 58.29,10.91 58.29,6.57 59.69,5.17 JP29.10
  Bottom 0.254: IC1.17 41.02,22.48 43.81,22.48 45.21,21.08 48.12,21.08 v58.28,10.92
PD4  (via drill 0.38)
  Top 0.254: v43.69,15.37 42.16,15.37 36.83,20.7 IC1.18 | JP29.11 57.15,5.73 56.01,6.87 56.01,10.79 v55.63,11.18
  Bottom 0.254: v43.69,15.37 47.88,11.18 v55.63,11.18
PD7  (via drill 0.38)
  Top 0.254: v45.59,7.24 47.83,5 52,5 54.46,2.54 JP29.12
  Bottom 0.254: IC1.21 33.66,10.79 45.09,10.79 45.59,10.29 v45.59,7.24
USB-RXD  (via drill 0.38)
  Top 0.254: v40.51,17.91 38.1,20.32 R8.P$1
  Bottom 0.254: v40.51,17.91 40.74,18.14 IC2.5
USB-TXD
  Bottom 0.254: IC2.1 41.66,20.83 40.01,22.48 38.99,22.48 37.85,23.62 37.85,25.15 37,26 36.23,26 R7.P$1
USBDM
  Bottom 0.254: J1.D- 15.24,10.92 17.02,12.7 18.41,12.7 19.43,11.68 28.32,11.68 29.57,12.94 IC2.16
USBDP  (via drill 0.38)
  Top 0.254: v33.15,12.06 28.32,12.06 v28.07,12.32
  Bottom 0.254: v33.15,12.06 33.37,12.29 IC2.15 | J1.D+ 15.11,8.89 14,10 14,12.1 15.11,13.21 18.67,13.21 19.68,12.19 27.94,12.19 v28.07,12.32
VBUS
  Top 0.254: R13.P$2 30.35,6.48 25.27,6.48 20.88,10.87 J1.VBUS
X-DIR  (via drill 0.38)
  Top 0.254: v42.93,26.04 42.93,21.59 44.07,20.45 44.07,16 49.53,10.54 IC1.28
  Bottom 0.254: P1.DIR 31.75,27.94 41.02,27.94 v42.93,26.04
X-MOT-1A
  Top 1.27: P1.1A JP1.3
X-MOT-1B
  Top 1.27: P1.1B JP1.4
X-MOT-2A
  Top 1.27: P1.2A JP1.2
X-MOT-2B
  Top 1.27: P1.2B JP1.1
X-MS1
  Top 0.254: P1.MS1 JP9.1
  Bottom 0.254: R2.P$1 22.48,33.91 17.27,33.91 15.24,31.88 JP9.1
X-MS2
  Bottom 0.254: P1.MS2 20.19,31.62 21.46,31.62 JP10.1
X-MS3
  Bottom 0.254: P1.MS3 21.59,30.48 24.64,30.48 26.04,31.88 27.81,31.88 JP11.1
X-RESETSLEEP
  Top 0.254: P1.!RST P1.!SLP
X-STEP
  Top 0.254: P1.STEP 28.07,29.21 29.84,27.43 29.84,23.5 31.75,21.59 34.29,21.59 41.91,13.97 43.56,13.97 46.99,10.54 IC1.27
X-STOP
  Top 0.254: JP26.1 36.83,6.35 IC1.23
XTAL1  (via drill 0.38)
  Top 0.254: v39.5,19.81 v43.43,19.81 | v46.23,20.19 49.53,23.5 IC1.13
  Bottom 0.254: v46.23,20.19 45.85,19.81 v43.43,19.81 | v39.5,19.81 39.24,20.07 37.34,20.07 36.2,21.21 28.32,21.21 Y1.3
XTAL2  (via drill 0.38)
  Top 0.254: v43.05,12.32 36.2,12.32 v32.89,15.62 | v44.83,16.26 52.07,23.5 IC1.12
  Bottom 0.254: v44.83,16.26 44.58,16 43.43,16 43.05,15.62 v43.05,12.32 | v32.89,15.62 32.64,15.37 27.56,15.37 Y1.1
Y-DIR/MISO  (via drill 0.38)
  Top 0.254: IC1.7 67.06,21.84 69.09,21.84 82.42,8.51 v82.42,8.26
  Bottom 0.254: P2.DIR 50.29,29.21 49.66,28.57 49.66,26.04 50.58,25.11 50.58,23.58 52.83,21.34 62.74,21.34 64.77,23.37 IC1.7 | SV1.1 88.27,8.26 v82.42,8.26
Y-MOT-1A
  Top 1.27: P2.1A JP3.3
Y-MOT-1B
  Top 1.27: P2.1B JP3.4
Y-MOT-2A
  Top 1.27: P2.2A JP3.2
Y-MOT-2B
  Top 1.27: P2.2B JP3.1
Y-MS1
  Top 0.254: P2.MS1 JP12.1 38.1,34.29 R3.P$1
Y-MS2
  Bottom 0.254: P2.MS2 40.51,31.62 41.78,31.62 JP13.1
Y-MS3
  Bottom 0.254: P2.MS3 41.91,30.48 44.96,30.48 46.35,31.88 48.13,31.88 JP14.1
Y-RESETSLEEP
  Top 0.254: P2.!RST P2.!SLP
Y-STEP/SCK  (via drill 0.38)
  Top 0.254: v53.21,25.91 50.93,28.19 49.02,28.19 49.02,28.32 48.26,29.08 P2.STEP | v78.74,10.54 67.94,21.34 65.02,21.34 IC1.8
  Bottom 0.254: SV1.3 86.36,7.62 82.17,7.62 81.66,8.13 81.66,9.91 81.03,10.54 v78.74,10.54 | IC1.8 62.23,23.37 60.71,21.84 54.74,21.84 53.21,23.37 v53.21,25.91
Y-STOP
  Top 0.254: JP27.1 41.91,6.86 40.01,8.76 39.5,8.76 IC1.24
Z-DIR
  Top 0.254: P3.DIR 71.12,25.4 IC1.4
Z-MOT-1A
  Top 1.27: P3.1A JP5.3
Z-MOT-1B
  Top 1.27: P3.1B JP5.4
Z-MOT-2A
  Top 1.27: P3.2A JP5.2
Z-MOT-2B
  Top 1.27: P3.2B JP5.1
Z-MS1
  Top 0.254: P3.MS1 JP15.1 58.42,34.29 R4.P$1
Z-MS2
  Bottom 0.254: P3.MS2 60.83,31.62 62.1,31.62 JP16.1
Z-MS3
  Bottom 0.254: P3.MS3 62.23,30.48 65.28,30.48 66.55,31.75 JP17.1
Z-RESETSLEEP
  Top 0.254: P3.!RST P3.!SLP
Z-STEP
  Top 0.254: P3.STEP 69.85,27.94 IC1.5
Z-STOP
  Top 0.254: JP28.1 49.34,4 46,4 41.91,8.09 IC1.25

### Text on the board
_tsilk: POWER | X-MOTOR | 12V PWR | Y-MOTOR | 12V PWR | Z-MOTOR | 12V PWR | E-MOTOR | PWR1/TIP | 2B | 2A | 1A | 1B | GND | +12V | 2B | 2A | 1A | 1B | GND | +12V | 2B | 2A | 1A | 1B | GND | +12V | 2B | 2A | 1A | 1B | -V | POLOLU-X | POLOLU-Y | POLOLU-Z | POLOLU-E | +12V | C1 | C2 | C3 | C4 | R1 | +12V | GND | R2 | R3 | R4 | R5 | Q1 | PWR2/BED | MS1 | MS2 | MS3 | MS1 | MS2 | MS3 | MS1 | MS2 | MS3 | MS1 | MS2 | MS3 | GND | -V | C5 | R7 | R6 | R8 | C6 | R9 | C7 | +12V | S1 | +5V | ATMEGA644 | Q2 | C9 | RESET | GND | 12V | C8 | R11 | C10 | E-THERM | R12 | C11 | R10 | C12 | C13 | B-THERM | R13 | R14 | !RESET | SCK | MISO | Sanguinololu | X-STOP | Y-STOP | Z-STOP | PWM | PWM | TX2 | RX2 | Rev 0.6 | ISP | USB2TTL | DTR | TX0 | RX1 | NC | GND | GND | GND | V+ | SIG | GND | V+ | SIG | GND | V+ | SIG | D15 | D12 | D11 | D10 | GND | 5V | A5 | A4 | A3 | A2 | A1 | A0 | GND | MOSI | 5V
_bsilk: X-MOTOR | 12V PWR | Y-MOTOR | 12V PWR | Z-MOTOR | 12V PWR | E-MOTOR | 2B | 2A | 1A | 1B | GND | +12V | 2B | 2A | 1A | 1B | GND | +12V | 2B | 2A | 1A | 1B | GND | +12V | 2B | 2A | 1A | 1B | PWR1/TIP | -V | +12V | +12V | GND | PWR2/BED | GND | -V | +12V | +5V | E-THERM | GND | 12V | FT232RL | B-THERM | 12V | ENDSTOP | VOLTAGE | 5V | USB2TTL | GND | V+ | SIG | GND | V+ | SIG | GND | V+ | SIG | DTR | TX0 | RX1 | NC | GND | GND | X-STOP | Y-STOP | Z-STOP | D15 | D12 | D11 | D10 | GND | 5V | A5 | A4 | A3 | A2 | A1 | A0